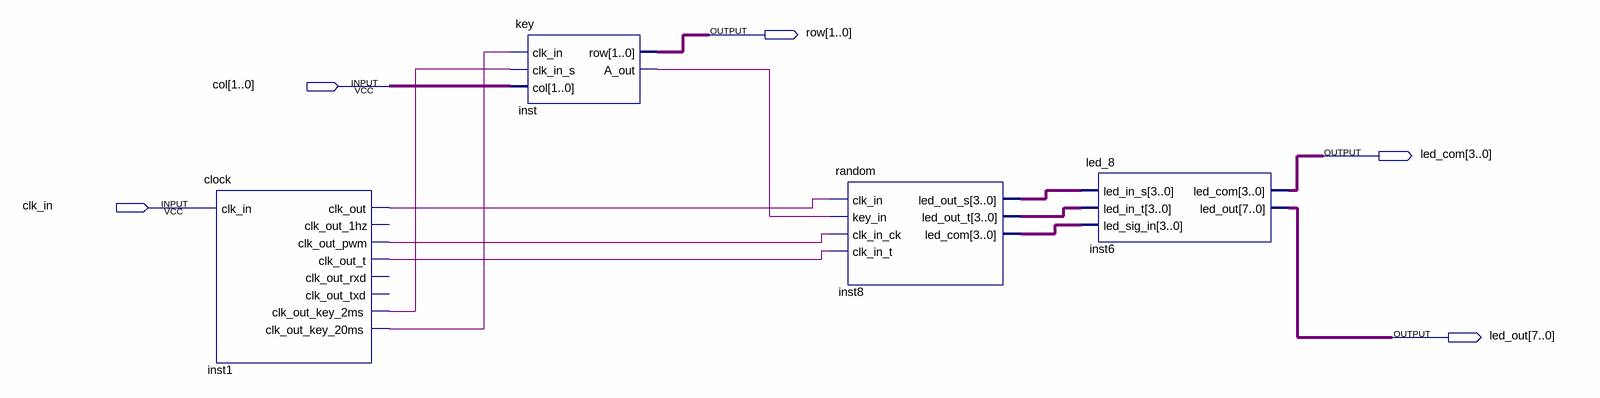
[diagram p0: schematic sheet]
// Quartus schematic random_bdf.bdf as structural Verilog: 4 symbols, 5 pins
module random_bdf (
  input  [1:0] col,
  input  clk_in,
  output [1:0] row,
  output [3:0] led_com,
  output [7:0] led_out
);

  wire inst1_clk_out, inst1_clk_out_key_2ms, inst1_clk_out_key_20ms, inst1_clk_out_pwm, inst1_clk_out_t,
       inst_a_out;
  wire [3:0] inst8_led_com, inst8_led_out_s, inst8_led_out_t;

  clock inst1 (
    .clk_in(clk_in), .clk_out(inst1_clk_out), .clk_out_pwm(inst1_clk_out_pwm), .clk_out_t(inst1_clk_out_t),
    .clk_out_key_2ms(inst1_clk_out_key_2ms), .clk_out_key_20ms(inst1_clk_out_key_20ms));  // open: clk_out_1hz, clk_out_rxd, clk_out_txd
  key inst (
    .clk_in(inst1_clk_out_key_20ms), .clk_in_s(inst1_clk_out_key_2ms), .col(col), .row(row),
    .A_out(inst_a_out));
  random inst8 (
    .clk_in(inst1_clk_out), .key_in(inst_a_out), .clk_in_ck(inst1_clk_out_pwm), .clk_in_t(inst1_clk_out_t),
    .led_out_s(inst8_led_out_s), .led_out_t(inst8_led_out_t), .led_com(inst8_led_com));
  led_8 inst6 (
    .led_in_s(inst8_led_out_s), .led_in_t(inst8_led_out_t), .led_sig_in(inst8_led_com), .led_com(led_com),
    .led_out(led_out));
endmodule
